# Altium project Amp_PCB_Project.PrjPCB
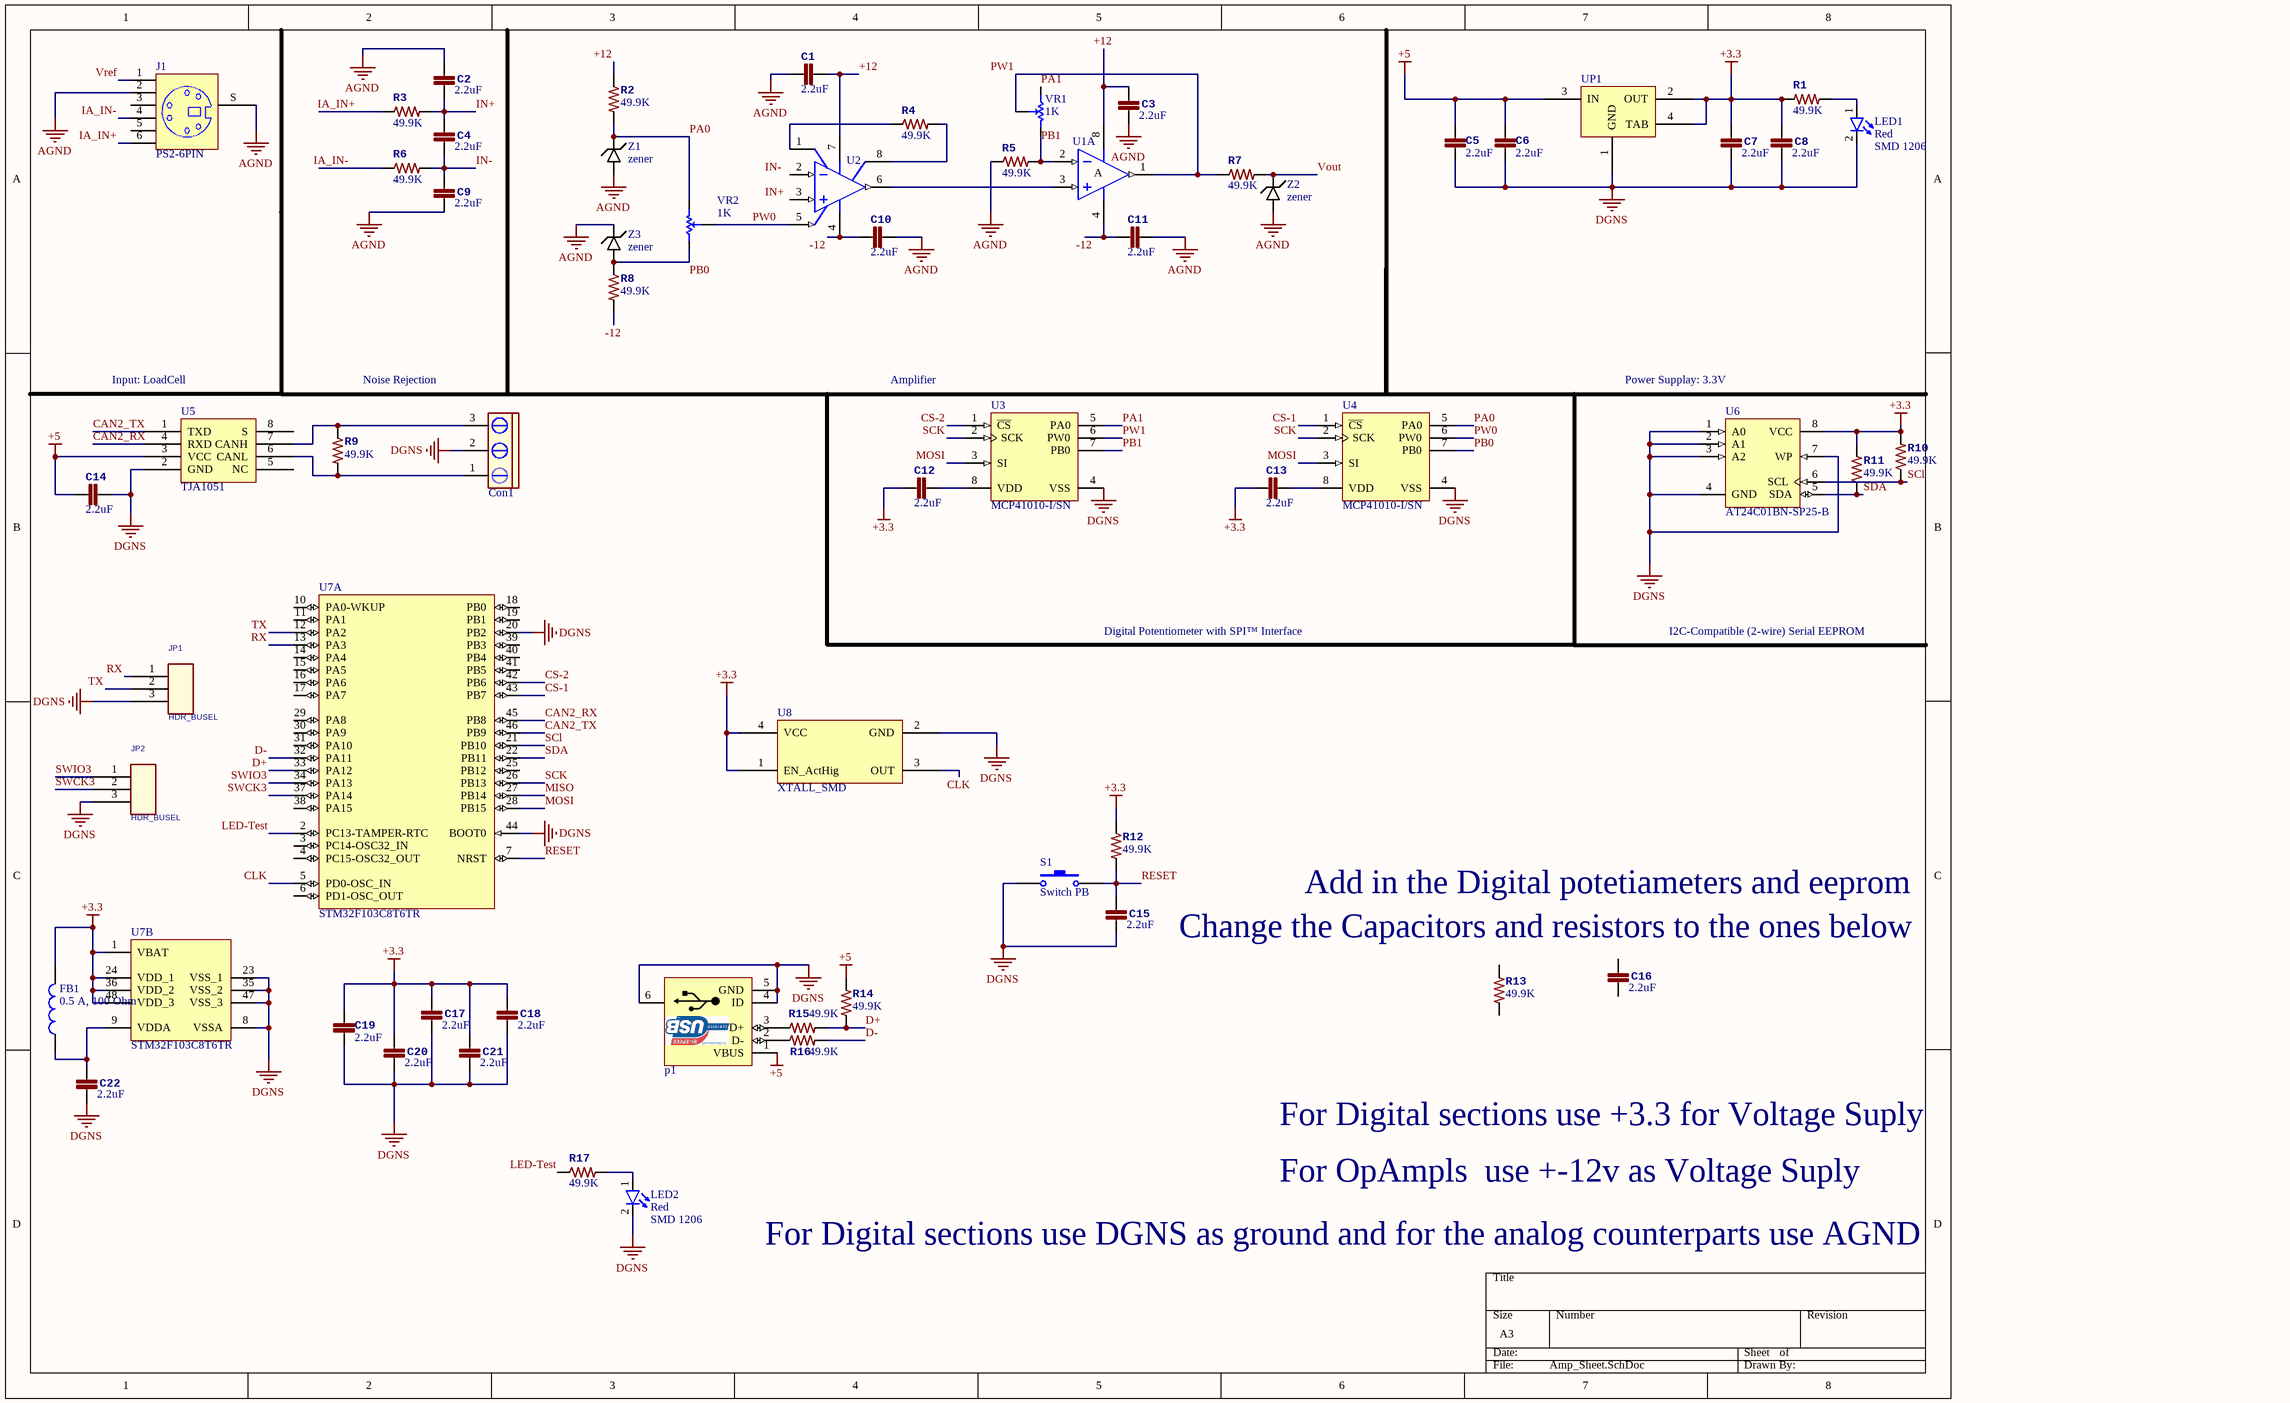
[diagram p0: Amp_Sheet.SchDoc]
2 sheets, 73 parts. Net scope: global (net labels, ports and power ports of the same name join across sheets).
Board file: Amp_PCB.PcbDoc
Sheets:
  Amp_Sheet.SchDoc
  Power.SchDoc

## Sheet Amp_Sheet.SchDoc
size A3

### Parts
C1  value 2.2uF  [_0805]  (hidden comment: Cap)
C2  value 2.2uF  [_0805]  (hidden comment: Cap)
C3  value 2.2uF  [_0805]  (hidden comment: Cap)
C4  value 2.2uF  [_0805]  (hidden comment: Cap)
C5  value 2.2uF  [_0805]  (hidden comment: Cap)
C6  value 2.2uF  [_0805]  (hidden comment: Cap)
C7  value 2.2uF  [_0805]  (hidden comment: Cap)
C8  value 2.2uF  [_0805]  (hidden comment: Cap)
C9  value 2.2uF  [_0805]  (hidden comment: Cap)
C10  value 2.2uF  [_0805]  (hidden comment: Cap)
C11  value 2.2uF  [_0805]  (hidden comment: Cap)
C12  value 2.2uF  [_0805]  (hidden comment: Cap)
C13  value 2.2uF  [_0805]  (hidden comment: Cap)
C14  value 2.2uF  [_0805]  (hidden comment: Cap)
C15  value 2.2uF  [_0805]  (hidden comment: Cap)
C16  value 2.2uF  [_0805]  (hidden comment: Cap)
C17  value 2.2uF  [_0805]  (hidden comment: Cap)
C18  value 2.2uF  [_0805]  (hidden comment: Cap)
C19  value 2.2uF  [_0805]  (hidden comment: Cap)
C20  value 2.2uF  [_0805]  (hidden comment: Cap)
C21  value 2.2uF  [_0805]  (hidden comment: Cap)
C22  value 2.2uF  [_0805]  (hidden comment: Cap)
Con1  CON3 pin Green  [My_CN3]  (value not drawn)
FB1  0.5 A, 100 Ohm  [0603_Wide Band/High Speed]
J1  PS2-6PIN  [My_PS2-6PIN]
JP1  HDR_BUSEL  [HDR_1x3]
JP2  HDR_BUSEL  [HDR_1x3]
LED1  Size: SMD 1206  [LED SMD 1206]  (hidden comment: Red)
LED2  Size: SMD 1206  [LED SMD 1206]  (hidden comment: Red)
p1  USB Connector  [USB_AB_BM_SHS]  (value not drawn)
R1  value 49.9K  [_0805]  (hidden comment: Resistor)
R2  value 49.9K  [_0805]  (hidden comment: Resistor)
R3  value 49.9K  [_0805]  (hidden comment: Resistor)
R4  value 49.9K  [_0805]  (hidden comment: Resistor)
R5  value 49.9K  [_0805]  (hidden comment: Resistor)
R6  value 49.9K  [_0805]  (hidden comment: Resistor)
R7  value 49.9K  [_0805]  (hidden comment: Resistor)
R8  value 49.9K  [_0805]  (hidden comment: Resistor)
R9  value 49.9K  [_0805]  (hidden comment: Resistor)
R10  value 49.9K  [_0805]  (hidden comment: Resistor)
R11  value 49.9K  [_0805]  (hidden comment: Resistor)
R12  value 49.9K  [_0805]  (hidden comment: Resistor)
R13  value 49.9K  [_0805]  (hidden comment: Resistor)
R14  value 49.9K  [_0805]  (hidden comment: Resistor)
R15  value 49.9K  [_0805]  (hidden comment: Resistor)
R16  value 49.9K  [_0805]  (hidden comment: Resistor)
R17  value 49.9K  [_0805]  (hidden comment: Resistor)
S1  Switch PB  [Switch - Push to On]
U1  TL072P  [P008]  (value not drawn)  (part A of 2)
U2  AD620AN  [N-8]  (value not drawn)
U3  MCP41010-I/SN  [SOIC-SN8_N]
U4  MCP41010-I/SN  [SOIC-SN8_N]
U5  TJA1051  [SO-8N]
U6  AT24C01BN-SP25-B  [8S1_N]
U7  STM32F103C8T6TR  [STM-LQFP48_N]  (parts A,B of 2)
U8  XTALL_SMD  [XTAL_SMD]
UP1  LM1117IMP-x.x  [SOT223_4]  (value not drawn)
VR1  1K  [Multi Turn 02]
VR2  1K  [Multi Turn 02]
Z1  zener  [zener]
Z2  zener  [zener]
Z3  zener  [zener]

### Nets
+3.3: C7.1 C8.1 C12.1 C13.1 C17.1 C18.1 C19.1 C20.1 C21.1 FB1.2 R1.1 R10.2 R11.2 R12.1 U6.8(VCC) U7.1(VBAT) U7.24(VDD_1) U7.36(VDD_2) U7.48(VDD_3) U8.1(EN_ActHig) U8.4(VCC) UP1.2(OUT) UP1.4(TAB)
+5: C5.1 C6.1 C14.2 p1.1(VBUS) R14.1 U5.3(VCC) UP1.3(IN)
AGND: C1.1 C2.1 C3.2 C9.2 C10.2 C11.2 J1.2 J1.S R5.1 Z1.1 Z2.1 Z3.2
DGNS: C5.2 C6.2 C7.2 C8.2 C14.1 C15.2 C17.2 C18.2 C19.2 C20.2 C21.2 C22.2 Con1.2 JP1.3 JP2.3 LED1.2(K) LED2.2(K) p1.4(ID) p1.5(GND) p1.6(MH) S1.1 U3.4(VSS) U4.4(VSS) U5.2(GND) U6.1(A0) U6.2(A1) U6.3(A2) U6.4(GND) U6.7(WP) U7.8(VSSA) U7.20(PB2) U7.23(VSS_1) U7.35(VSS_2) U7.44(BOOT0) U7.47(VSS_3) U8.2(GND) UP1.1(GND)
+12: C1.2 C3.1 R2.1 U1.8(V+) U2.7(V+)
-12: C10.1 C11.1 R8.2 U1.4(V-) U2.4(V-)
CAN2_RX: U5.4(RXD) U7.45(PB8)
CAN2_TX: U5.1(TXD) U7.46(PB9)
CLK: U7.5(PD0-OSC_IN) U8.3(OUT)
CS-1: U4.1(~{CS}) U7.43(PB7)
CS-2: U3.1(~{CS}) U7.42(PB6)
D+: R14.2 R15.2 U7.33(PA12)
D-: R16.2 U7.32(PA11)
IA_IN+: J1.6 R3.1
IA_IN-: J1.4 R6.1
IN+: C2.2 C4.1 R3.2
IN-: C4.2 C9.1 R6.2
LED-Test: R17.1 U7.2(PC13-TAMPER-RTC)
MISO: U7.27(PB14)
MOSI: U3.3(SI) U4.3(SI) U7.28(PB15)
PA0: R2.2 U4.5(PA0) VR2.2(CW) Z1.2
PA1: U3.5(PA0) VR1.1(CCW)
PB0: R8.1 U4.7(PB0) VR2.1(CCW) Z3.1
PB1: R5.2 U1.2(IN-) U3.7(PB0) VR1.2(CW)
PW0: U2.5(REF) U4.6(PW0) VR2.3(Setpoint)
PW1: R7.1 U1.1(OUT) U3.6(PW0) VR1.3(Setpoint)
RESET: C15.1 R12.2 S1.2 U7.7(NRST)
RX: JP1.1 U7.13(PA3)
SCK: U3.2(SCK) U4.2(SCK) U7.26(PB13)
SCl: R10.1 U6.6(SCL) U7.21(PB10)
SDA: R11.1 U6.5(SDA) U7.22(PB11)
SWCK3: JP2.2 U7.37(PA14)
SWIO3: JP2.1 U7.34(PA13)
TX: JP1.2 U7.12(PA2)
Vout: R7.2 Z2.2
Vref: J1.1
NetC12_2: C12.2 U3.8(VDD)
NetC13_2: C13.2 U4.8(VDD)
NetC22_1: C22.1 FB1.1 U7.9(VDDA)
NetCon1_1: Con1.1 R9.2 U5.6(CANL)
NetCon1_3: Con1.3 R9.1 U5.7(CANH)
NetLED1_1: LED1.1(A) R1.2
NetLED2_1: LED2.1(A) R17.2
Netp1_2: p1.2(D-) R16.1
Netp1_3: p1.3(D+) R15.1
NetR4_1: R4.1 U2.1(RG)
NetR4_2: R4.2 U2.8(RG)
NetU1_3: U1.3(IN+) U2.6(OUT)

Not connected (* = marked no-connect by the designer): C16 1 2; J1 3 5; R13 1 2; U2 2(-IN) 3(+IN); U5 5(NC) 8(S); U7 3(PC14-OSC32_IN) 4(PC15-OSC32_OUT) 6(PD1-OSC_OUT) 10(PA0-WKUP) 11(PA1) 14(PA4) 15(PA5) 16(PA6) 17(PA7) 18(PB0) 19(PB1) 25(PB12) 29(PA8) 30(PA9) 31(PA10) 38(PA15) 39(PB3) 40(PB4) 41(PB5)

### Notes on the sheet
- (near U5) Input: LoadCell
- Noise Rejection
- Amplifier
- (near U6) Power Supplay: 3.3V
- Digital Potentiometer with SPI™ Interface
- I2C-Compatible (2-wire) Serial EEPROM
- Add in the Digital potetiameters and eeprom
- Change the Capacitors and resistors to the ones below
- For Digital sections use +3.3 for Voltage Suply
- For OpAmpls  use +-12v as Voltage Suply
- For Digital sections use DGNS as ground and for the analog counterparts use AGND
- Labels drawn without touching a wire or pin: IN+, IN-
- (in symbol TL072P, part A) A
- (in symbol USB AB MICRO CONNECTOR) D:AbbasBasereh

### Library data of the parts
C1-C22 = Cap_1
Con1 = CON3 pin Green: Connector green screw
FB1 = Bead: WE-CBA SMD EMI Suppression Ferrite Bead, 0603, High Speed, 0.5 A, 100 Ohm; Part Number: 782631101; Rated Current: 0.5 A; Impedance: 100 Ohm; DC Resistance max.: 0.2 Ohm; ComponentLink1Description: Manufacturer; ComponentLink1URL: http://www.we-online.de; ComponentLink2Description: Datasheet; ComponentLink2URL: http://katalog.we-online.de/pbs/datasheet/782631101.pdf; Published Date: Oct. 2017; Publisher: Wurth Elektronik; Size: 0603; Type: High Speed; Operating Temperature: -55 to 125 degC
J1 = PS2-6PIN: 6 Pin Through Hole PS2 Socket (Kycon P/N); Published: 17-Dec-2003; Publisher: Altium Limited; ComponentLink1Description: Manufacturer Link; ComponentLink1URL: http://www.oupiin.com/prodindx.html#Headers
JP1 JP2 = Header 1x3: header or jumper box
LED1 LED2 = LED: Designer: Saeid Jorablo; Organazation: ControTec; Adding Date: 1387/12/22; Color: Red
p1 = USB AB MICRO CONNECTOR: USB MICRO-B Type Connector; Designer: ABBAS BASEREH; Max Current: 1600mA; Mounting Technology: Surface Mount\Through-Hole; Category: Connector; Pin Count: 5-7; Publisher: ABBAS BASEREH; Status: Unreleased; ComponentLink1Description: Datasheet; ComponentLink2Description: Reference; Update: 1395-11-17
S1 = Switch PB: Push Button Switch
U1 = TL072P: Low-Noise JFET-Input Operational Amplifier; Published: 16-Jan-2001; LatestRevisionDate: 04-Mar-2005; LatestRevisionNote: Stylized 3D Model Added.; DatasheetVersion: Aug-1996; PackageVersion: Jun-1999; PackageReference: P008; Publisher: Altium Limited; PackageDescription: DIP; 8 Leads; Row Spacing 7.62 mm; Pitch 2.54 mm; Code_JEDEC: MO-001-AN; ComponentLink1Description: Manufacturer Link; ComponentLink1URL: http://www.ti.com/; ComponentLink2Description: Datasheet; ComponentLink2URL: http://www-s.ti.com/sc/ds/tl072.pdf
U2 = AD620AN: Low-Cost, Low-Power Instrumentation Amplifier; Published: 8-Jun-2000; LatestRevisionDate: 04-Mar-2005; LatestRevisionNote: Stylized 3D Model Added.; DatasheetVersion: REV.D 1998; PackageVersion: revA; PackageReference: N-8; Publisher: Altium Limited; PackageDescription: DIP; 8 Leads; Row Spacing 7.62 mm; Pitch 2.54 mm; ComponentLink1Description: Manufacturer Link; ComponentLink1URL: http://www.analog.com/en/prod/0%2C2877%2CAD620%2C00.html; ComponentLink2Description: Datasheet; ComponentLink2URL: http://www.analog.com/UploadedFiles/Data_Sheets/897653854AD620_g.pdf
U3 U4 = MCP41010-I/SN: Single/Dual Digital Potentiometer with SPI Interface, 8-Pin SOIC 150mil, Industrial Temperature; DatasheetVersion: Jul-2003; PackageVersion: revBB, Aug-2009; PackageReference: SOIC-SN8; PackageDescription: 8-Lead Plastic Small Outline (SN) - Narrow, 3.90mm Body [SOIC]; Code_JEDEC: MS-012; Code_IPC: SOIC127P600-8; ComponentLink1Description: Manufacturer URL; ComponentLink1URL: http://www.microchip.com/; ComponentLink2Description: Datasheet; ComponentLink2URL: http://ww1.microchip.com/downloads/en/DeviceDoc/11195c.pdf; ComponentLink3Description: Package Specification; ComponentLink3URL: http://www.microchip.com/stellent/groups/techpub_sg/documents/packagingspec/en012702.pdf
U6 = AT24C01BN-SP25-B: 1Kbit (128 x 8), 2-wire Bus Automotive Serial EEPROM with Write Protect, 2.5V, 8-Pin SOIC, Bulk; Published: 20-Sep-2010; DatasheetVersion: 8517C,  Jan-2009; PackageVersion: revC, Mar-2005; PackageReference: 8S1; Publisher: Altium Limited; PackageDescription: 8-Lead (0.150" Wide Body), Plastic Gull Wing Small Outline (JEDEC SOIC); Code_JEDEC: MS-012-AA; Code_IPC: SOIC127P600-8; ComponentLink1Description: Manufacturer Link; ComponentLink1URL: http://www.atmel.com/products/serial/default.asp; ComponentLink2Description: Datasheet; ComponentLink2URL: http://www.atmel.com/dyn/resources/prod_documents/doc8517.pdf; ComponentLink3Description: Atmel.com Home; ComponentLink3URL: http://www.atmel.com
U7 = STM32F103C8T6TR: ARM Cortex-M3 32-bit MCU, 64 KB Flash, 20 KB Internal RAM, 37 I/Os, 48-pin LQFP, -40 to 85 degC, Tape and Reel; A/D Converter: 2x12-bit (10 Channel); FLASH Size (Prog) (kB): 64; I/Os (High Current): 37; Internal RAM Size (kB): 20; Operating Frequency(F) (Processor speed) (MHz): 72; Supply Voltage(Vcc) min (V): 2; DatasheetVersion: Rev. 16; PackageVersion: Rev. 6, 06/2013; PackageReference: LQFP48; PackageDescription: 48-Pin Low Profile Quad Flat Package, 7 x 7 mm Body, 0.5 mm Pitch; Supplier 1: Digi-Key; Supplier Part Number 1: STM32F103C8T6TR-ND; Supplier 2: Mouser; Supplier Part Number 2: 511-STM32F103C8T6TR; Core: ARM Cortex-M3; Packing: Tape and Reel; Mounting Technology: Surface Mount; PartNumber: STM32F103C8T6TR; ComponentLink1Description: Manufacturer URL; ComponentLink1URL: http://www.st.com/web/en/home.html; ComponentLink2Description: Datasheet; ComponentLink2URL: http://www.st.com/st-web-ui/static/active/en/resource/technical/document/datasheet/CD00161566.pdf; ComponentLink3Description: Package Specification; ComponentLink3URL: http://www.st.com/st-web-ui/static/active/en/resource/technical/document/datasheet/DM00058181.pdf
U8 = XTAL_SMD
UP1 = LM1117IMP-x.x: x.x Volt, 800mA Low-Dropout Linear Regulator, 4-pin SOT-223; Designer: Abbas Basereh; Data: 16-12-2016; VALUE: LM1117IMP-x.x
VR1 VR2 = Resistor Variable: Variable Resistor; Designer: Saeid Jorablo; Company: ControTec; Adding Date: 137/12/22; Value: 1K

## Sheet Power.SchDoc
size A
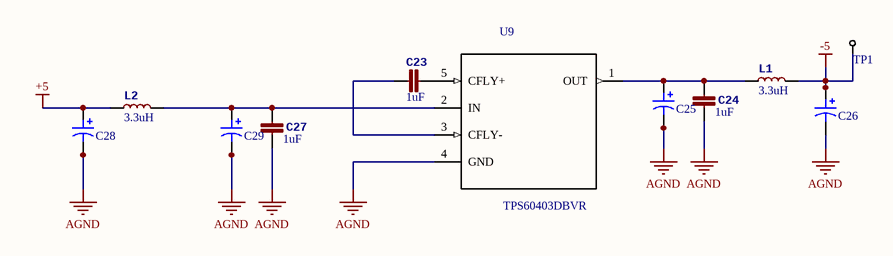
[diagram p1: Power.SchDoc]

### Parts
C23  value 1uF  [_0805]  (hidden comment: Cap)
C24  value 1uF  [_0805]  (hidden comment: Cap)
C25  100uF50V  [Cap electrolitic radial 10x20-5]  (value not drawn)
C26  100uF50V  [Cap electrolitic radial 10x20-5]  (value not drawn)
C27  value 1uF  [_0805]  (hidden comment: Cap)
C28  100uF50V  [Cap electrolitic radial 10x20-5]  (value not drawn)
C29  100uF50V  [Cap electrolitic radial 10x20-5]  (value not drawn)
L1  value 3.3uH  [_INDUCTOR-SMD-6.0mm]  (hidden comment: Inductor)
L2  value 3.3uH  [_INDUCTOR-SMD-6.0mm]  (hidden comment: Inductor)
TP1  Test Point  [Test Point]  (value not drawn)
U9  TPS60403DBVR  [*SOT95P280X145-5N]

### Nets
+5: C28.1 L2.1
-5: C26.1 L1.2 TP1.1(T)
AGND: C24.2 C25.2 C26.2 C27.2 C28.2 C29.2 U9.4(GND)
NetC23_1: C23.1 U9.3(CFLY-)
NetC23_2: C23.2 U9.5(CFLY+)
NetC24_1: C24.1 C25.1 L1.1 U9.1(OUT)
NetC27_1: C27.1 C29.1 L2.2 U9.2(IN)

### Library data of the parts
C23 C24 C27 = Cap_1
C25 C26 C28 C29 = Cap ELECTROLITIC TOTAL SIZE: Cap electrolitic radial; Designer: Abbas Basereh; Data: 16-12-2016; Part. No: *; VALUE: 100uF50V
U9 = TPS60403DBVR: 60mA Charge Pump Voltage Inverter with Fixed 250kHz Operation 5-SOT-23 -40 to 85; MF: Texas Instruments; Package: SOT-23-5 Texas Instruments; Price: None; SnapEDA_Link: https://www.snapeda.com/parts/TPS60403DBVR/Texas%20Instruments/view-part/?ref=snap; MP: TPS60403DBVR; Availability: Unavailable; Value: *

## Nets that join several sheets
+5: Amp_Sheet (7 pins), Power (C28.1 L2.1)
AGND: Amp_Sheet (12 pins), Power (7 pins)